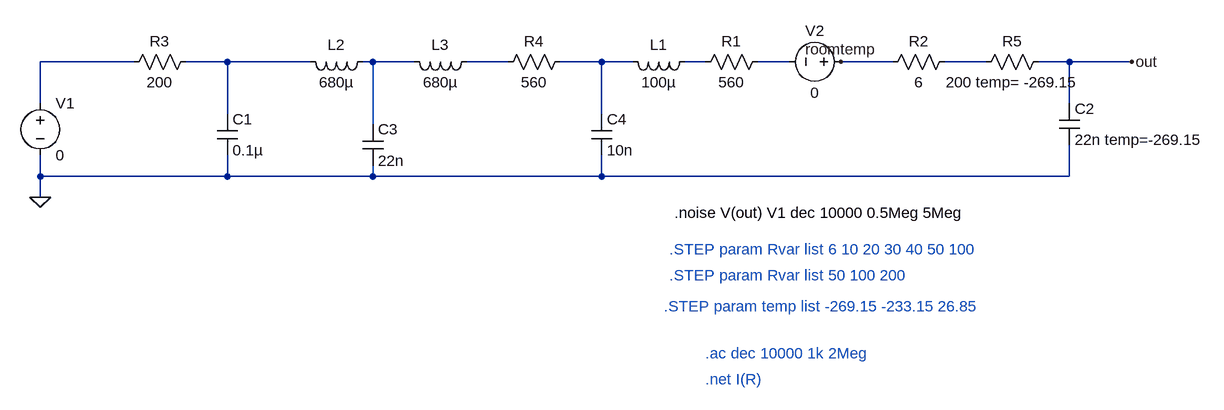
[diagram p0: schematic prevFB.asc]
prevFB.asc, the LTspice schematic file:
Version 4
SHEET 1 1660 712
WIRE 0 208 -144 208
WIRE 144 208 80 208
WIRE 272 208 144 208
WIRE 368 208 352 208
WIRE 432 208 368 208
WIRE 576 208 512 208
WIRE 720 208 656 208
WIRE 768 208 720 208
WIRE 880 208 848 208
WIRE 1008 208 960 208
WIRE 1168 208 1088 208
WIRE 1312 208 1248 208
WIRE 1440 208 1392 208
WIRE 1536 208 1440 208
WIRE -144 272 -144 208
WIRE 1440 272 1440 208
WIRE 144 288 144 208
WIRE 720 288 720 208
WIRE 368 304 368 208
WIRE -144 384 -144 352
WIRE 144 384 144 352
WIRE 144 384 -144 384
WIRE 368 384 368 368
WIRE 368 384 144 384
WIRE 720 384 720 352
WIRE 720 384 368 384
WIRE 1440 384 1440 336
WIRE 1440 384 720 384
WIRE -144 416 -144 384
FLAG 1536 208 out
FLAG 1088 208 roomtemp
FLAG -144 416 0
SYMBOL voltage -144 256 R0
SYMATTR InstName V1
SYMATTR Value 0
SYMBOL cap 1424 272 R0
SYMATTR InstName C2
SYMATTR Value 22n temp=-269.15
SYMBOL ind 864 192 R90
WINDOW 0 5 56 VBottom 2
WINDOW 3 32 56 VTop 2
SYMATTR InstName L1
SYMATTR Value 100µ
SYMBOL res 976 192 R90
WINDOW 0 0 56 VBottom 2
WINDOW 3 32 56 VTop 2
SYMATTR InstName R1
SYMATTR Value 560
SYMBOL res 1264 192 R90
WINDOW 0 0 56 VBottom 2
WINDOW 3 32 56 VTop 2
SYMATTR InstName R2
SYMATTR Value 6
SYMBOL ind 368 192 R90
WINDOW 0 5 56 VBottom 2
WINDOW 3 32 56 VTop 2
SYMATTR InstName L2
SYMATTR Value 680µ
SYMBOL cap 352 304 R0
SYMATTR InstName C3
SYMATTR Value 22n
SYMBOL ind 528 192 R90
WINDOW 0 5 56 VBottom 2
WINDOW 3 32 56 VTop 2
SYMATTR InstName L3
SYMATTR Value 680µ
SYMBOL res 672 192 R90
WINDOW 0 0 56 VBottom 2
WINDOW 3 32 56 VTop 2
SYMATTR InstName R4
SYMATTR Value 560
SYMBOL cap 704 288 R0
SYMATTR InstName C4
SYMATTR Value 10n
SYMBOL res 96 192 R90
WINDOW 0 0 56 VBottom 2
WINDOW 3 32 56 VTop 2
SYMATTR InstName R3
SYMATTR Value 200
SYMBOL cap 128 288 R0
SYMATTR InstName C1
SYMATTR Value 0.1µ
SYMBOL res 1408 192 R90
WINDOW 0 0 56 VBottom 2
WINDOW 3 32 56 VTop 2
SYMATTR InstName R5
SYMATTR Value 200 temp= -269.15
SYMBOL voltage 1104 208 R90
WINDOW 0 -32 56 VBottom 2
WINDOW 3 32 56 VTop 2
SYMATTR InstName V2
SYMATTR Value 0
TEXT 832 440 Left 2 !.noise V(out) V1 dec 10000 0.5Meg 5Meg
TEXT 824 496 Left 2 ;.STEP param Rvar list 6 10 20 30 40 50 100
TEXT 824 536 Left 2 ;.STEP param Rvar list 50 100 200
TEXT 816 584 Left 2 ;.STEP param temp list -269.15 -233.15 26.85
TEXT 880 656 Left 2 ;.ac dec 10000 1k 2Meg
TEXT 880 696 Left 2 ;.net I(R)

The netlist it stands for:
* prevFB.asc
V1 N001 0 0
C2 out 0 22n temp=-269.15
L1 N006 N005 100µ
R1 N007 N006 560
R2 N008 roomtemp 6
L2 N003 N002 680µ
C3 N003 0 22n
L3 N004 N003 680µ
R4 N005 N004 560
C4 N005 0 10n
R3 N002 N001 200
C1 N002 0 0.1µ
R5 out N008 200 temp= -269.15
V2 roomtemp N007 0
.noise V(out) V1 dec 10000 0.5Meg 5Meg
* .STEP param Rvar list 6 10 20 30 40 50 100
* .STEP param Rvar list 50 100 200
* .STEP param temp list -269.15 -233.15 26.85
* .ac dec 10000 1k 2Meg
* .net I(R)
.backanno
.end